# EAGLE design CT-Keypad-Rev4 (EAGLE 6.2)
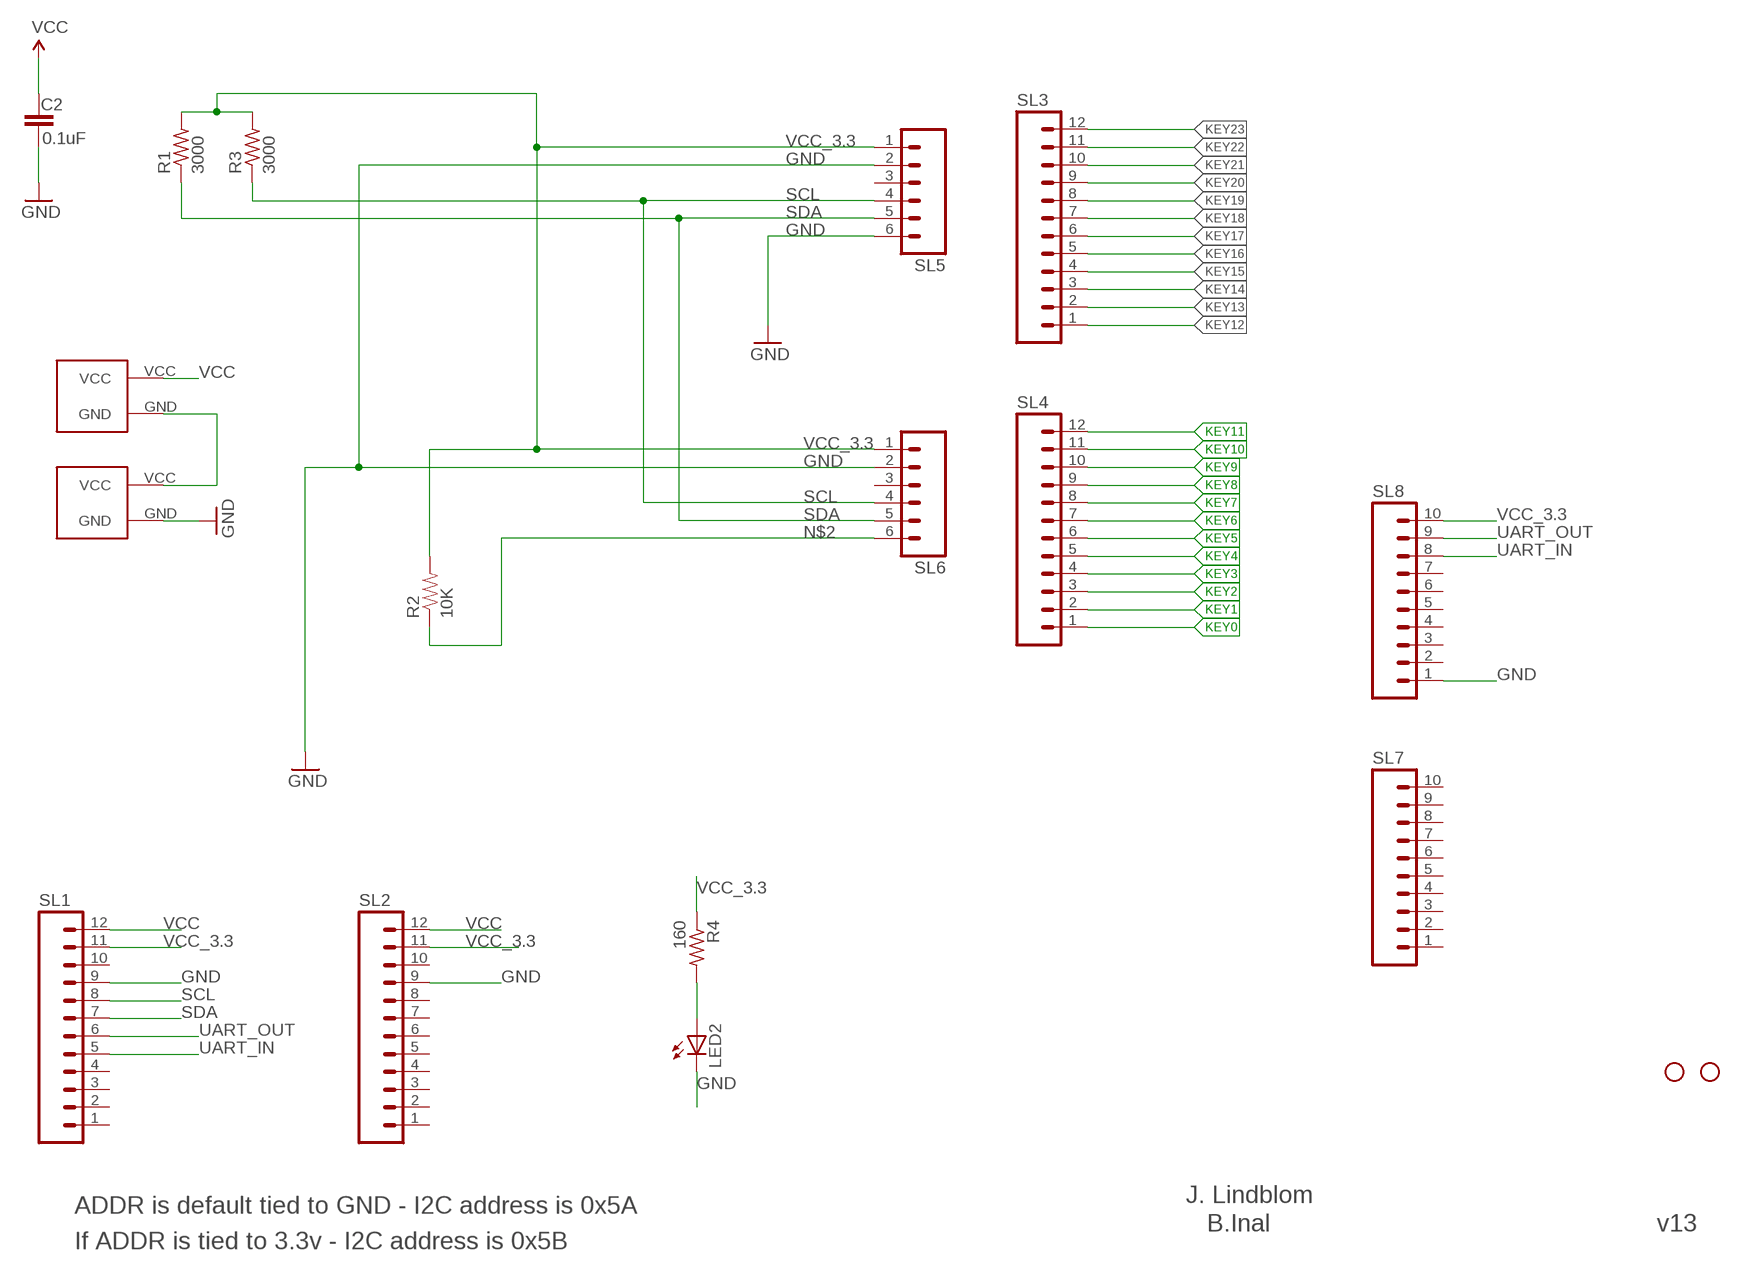
[diagram p0: schematic, sheet 1]

## Parts
C2  0.1uF  0.1UF-25V(+80/-20%)(0603)  [0603-CAP]
JP3  STAND-OFF  [STAND-OFF]
JP4  STAND-OFF  [STAND-OFF]
LED2  LEDCHIPLED_0805  [CHIPLED_0805]
R1  3000  R-US_R0603  [R0603]
R2  10K  10KOHM1/10W1%(0603)0603  [0603-RES]
R3  3000  R-US_R0603  [R0603]
R4  160  R-US_R0603  [R0603]
SL1  M12  [12P]
SL2  M12  [12P]
SL3  M12  [12P]
SL4  M12  [12P]
SL5  M06  [06P]
SL6  M06  [06P]
SL7  M10  [10P]
SL8  M10  [10P]
U$1  BATTERY  [BATTERY]
U$2  BATTERY  [BATTERY]

## Nets
GND: C2.2 LED2.C SL1.9 SL2.9 SL5.2 SL5.6 SL6.2 SL8.1 U$2.GND
KEY0: SL4.1
KEY1: SL4.2
KEY2: SL4.3
KEY3: SL4.4
KEY4: SL4.5
KEY5: SL4.6
KEY6: SL4.7
KEY7: SL4.8
KEY8: SL4.9
KEY9: SL4.10
KEY10: SL4.11
KEY11: SL4.12
KEY12: SL3.1
KEY13: SL3.2
KEY14: SL3.3
KEY15: SL3.4
KEY16: SL3.5
KEY17: SL3.6
KEY18: SL3.7
KEY19: SL3.8
KEY20: SL3.9
KEY21: SL3.10
KEY22: SL3.11
KEY23: SL3.12
N$2: R2.1 SL6.6
N$4: LED2.A R4.2
N$5: U$1.GND U$2.VCC
SCL: R3.1 SL1.8 SL5.4 SL6.4
SDA: R1.1 SL1.7 SL5.5 SL6.5
UART_IN: SL1.5 SL8.8
UART_OUT: SL1.6 SL8.9
VCC: C2.1 SL1.12 SL2.12 U$1.VCC
VCC_3.3: R1.2 R2.2 R3.2 R4.1 SL1.11 SL2.11 SL5.1 SL6.1 SL8.10
Unconnected: SL1.1 SL1.2 SL1.3 SL1.4 SL1.10 SL2.1 SL2.2 SL2.3 SL2.4 SL2.5 SL2.6 SL2.7 SL2.8 SL2.10 SL5.3 SL6.3 SL7.1 SL7.2 SL7.3 SL7.4 SL7.5 SL7.6 SL7.7 SL7.8 SL7.9 SL7.10 SL8.2 SL8.3 SL8.4 SL8.5 SL8.6 SL8.7

## Notes on the sheet
- J. Lindblom
- ADDR is default tied to GND - I2C address is 0x5A
- B.Inal | v13
- If ADDR is tied to 3.3v - I2C address is 0x5B

## Library data of the parts
C2 = SparkFun-Capacitors:0.1UF-25V(+80/-20%)(0603): Ceramic Standard decoupling cap CAP-00810; PROD_ID: CAP-00810
JP3 JP4 = SparkFun:STAND-OFF: Stand Off This is the mechanical footprint for a #4 phillips button head screw. Use the keepout ring to avoid running the screw head into surrounding components. SKU : PRT-00447
LED2 = led:LED: LED OSRAM: - CHIPLED LG R971, LG N971, LY N971, LG Q971, LY Q971, LO R971, LY R971 LH N974, LH R974 LS Q976, LO Q976, LY Q976 LO Q996 - Hyper CHIPLED LW Q18S LB Q993, LB Q99A, LB R99A - SideLED LS A670, LO A670, LY A670, LG A670, LP A670 LB A673, LV A673, LT A673, LW A673 LH A674 LY A675 LS A676, LA A676, LO A676, LY A676, LW A676 LS A679, LY A679, LG A679 - Hyper Micro SIDELED® LS Y876, LA Y876, LO Y876, LY Y876 LT Y87S - SmartLED LW L88C, LW L88S LB L89C, LB L89S, LG L890 LS L89K, LO L89K, LY L89K LS L896, LA L896, LO L896, LY L896 - TOPLED LS T670, LO T670, LY T670, LG T670, LP T670 LSG T670, LSP T670, LSY T670, LOP T670, LYG T670 LG T671, LOG T671, LSG T671 LB T673, LV T673, LT T673, LW T673 LH T674 LS T676, LA T676, LO T676, LY T676, LB T676, LH T676, LSB T676, LW T676 LB T67C, LV T67C, LT T67C, LS T67K, LO T67K, LY T67K, LW E67C LS E67B, LA E67B, LO E67B, LY E67B, LB E67C, LV E67C, LT E67C LW T67C LS T679, LY T679, LG T679 LS T770, LO T770, LY T770, LG T770, LP T770 LB T773, LV T773, LT T773, LW T773 LH T774 LS E675, LA E675, LY E675, LS T675 LS T776, LA T776, LO T776, LY T776, LB T776 LHGB T686 LT T68C, LB T68C - Hyper Mini TOPLED® LB M676 - Mini TOPLED Santana® LG M470 LS M47K, LO M47K, LY M47K Source: http://www.osram.convergy.de LUXEON: - LUMILED® LXK2-PW12-R00, LXK2-PW12-S00, LXK2-PW14-U00, LXK2-PW14-V00 LXK2-PM12-R00, LXK2-PM12-S00, LXK2-PM14-U00 LXK2-PE12-Q00, LXK2-PE12-R00, LXK2-PE12-S00, LXK2-PE14-T00, LXK2-PE14-U00 LXK2-PB12-K00, LXK2-PB12-L00, LXK2-PB12-M00, LXK2-PB14-N00, LXK2-PB14-P00, LXK2-PB14-Q00 LXK2-PR12-L00, LXK2-PR12-M00, LXK2-PR14-Q00, LXK2-PR14-R00 LXK2-PD12-Q00, LXK2-PD12-R00, LXK2-PD12-S00 LXK2-PH12-R00, LXK2-PH12-S00 LXK2-PL12-P00, LXK2-PL12-Q00, LXK2-PL12-R00 Source: www.luxeon.com KINGBRIGHT: KA-3528ASYC Source: www.kingbright.com
R1 R3 R4 = rcl:R-US_: RESISTOR, American symbol
R2 = SparkFun-Resistors:10KOHM1/10W1%(0603): RES-00824; PROD_ID: RES-00824
SL1-SL4 = con-amp-quick:M12: AMP QUICK CONNECTOR; OC_FARNELL: unknown; OC_NEWARK: unknown
SL5 SL6 = con-amp-quick:M06: AMP QUICK CONNECTOR; OC_FARNELL: unknown; OC_NEWARK: unknown
SL7 SL8 = con-amp-quick:M10: AMP QUICK CONNECTOR; OC_FARNELL: unknown; OC_NEWARK: unknown
U$1 U$2 = battery:BATTERY

## Board
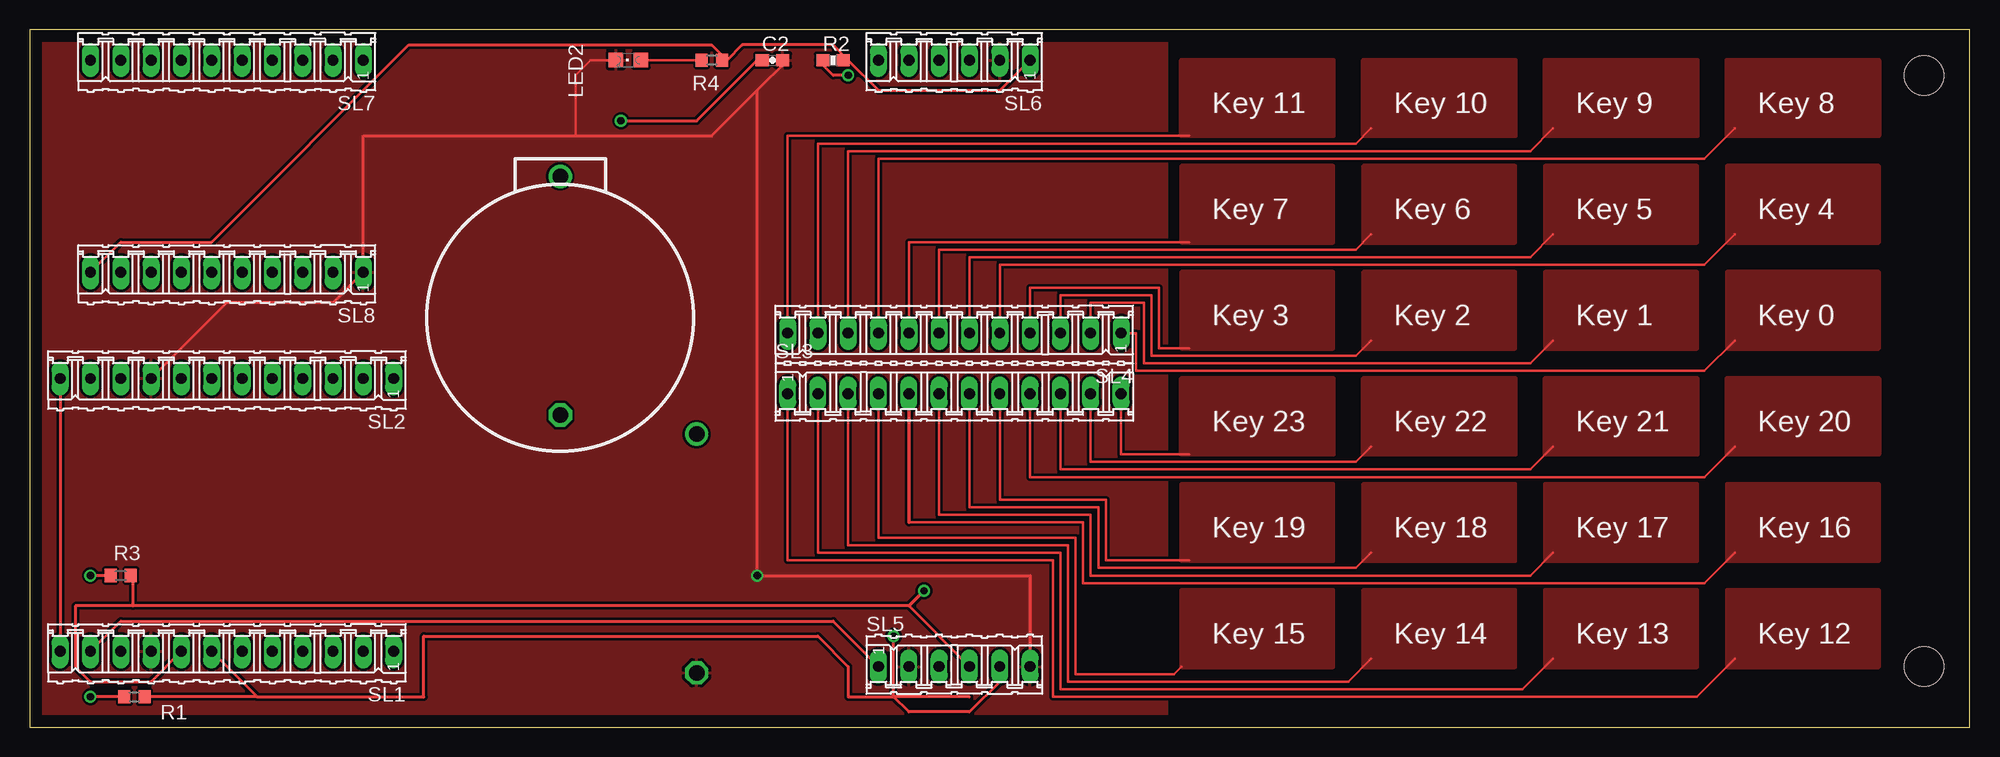
[diagram p1: board, top side]
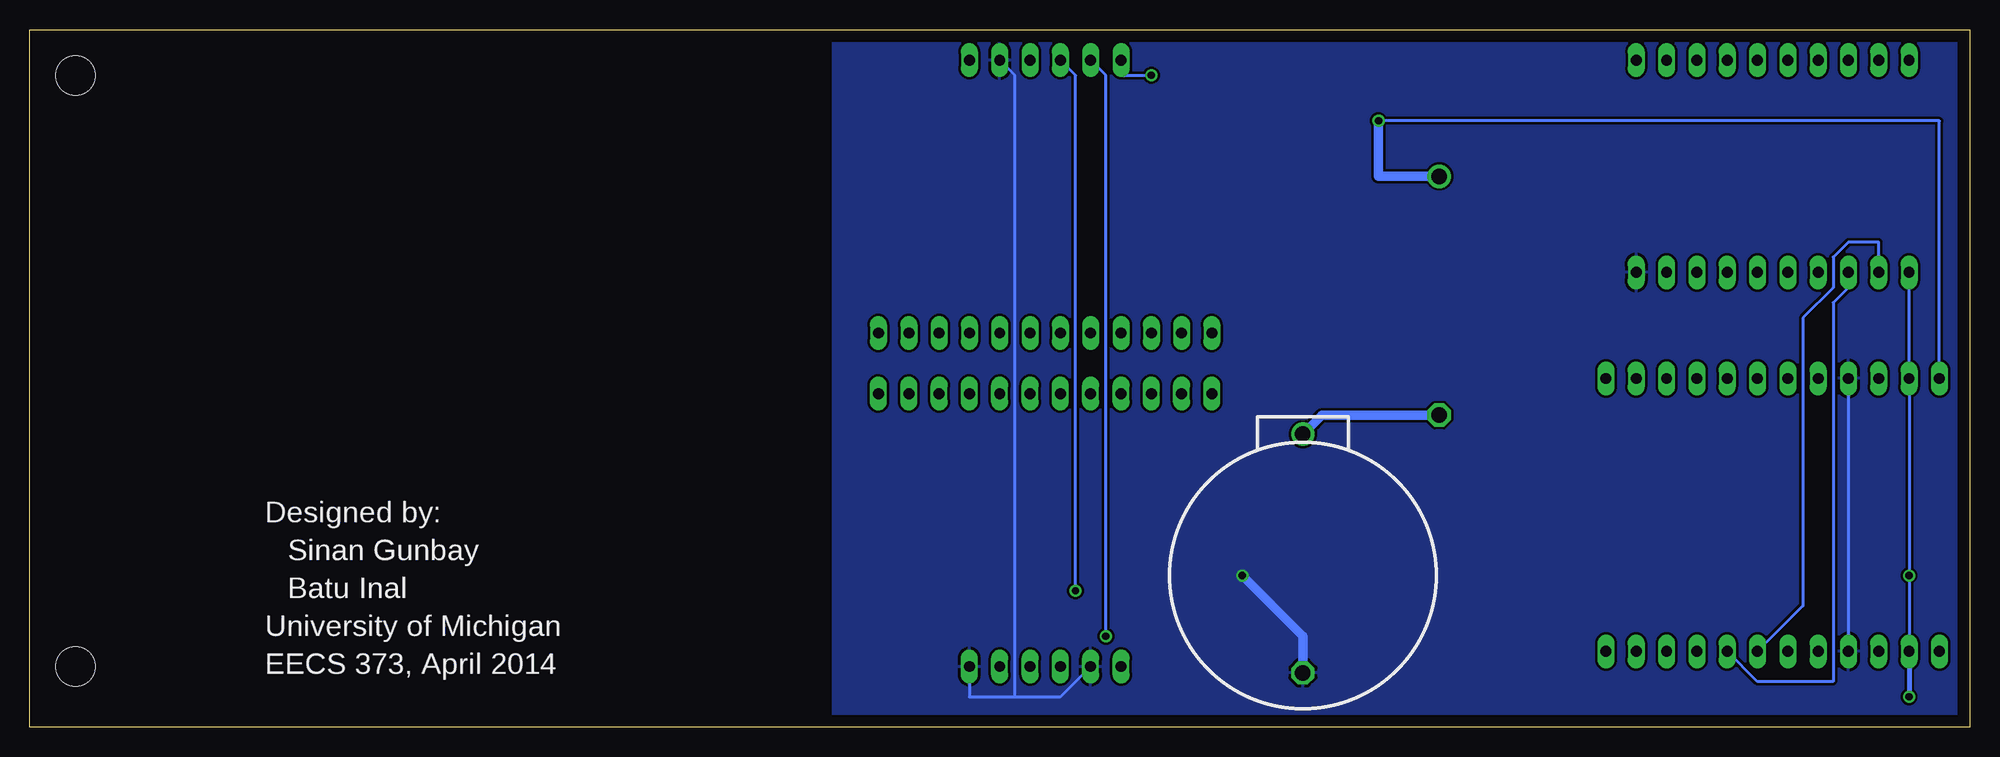
[diagram p2: board, bottom side, seen from below]

Size 162.56 x 58.42 mm. Coordinates in mm from the lower left corner, seen from the top.
Outline: 0,0 162.56,0 162.56,58.42 0,58.42 0,0
Copper layers (1*16): Top 0.035mm / dielectric 1.5mm / Bottom 0.035mm
Design rules: minimum track width 8mil, minimum drill 14mil, track to track 8mil, track to pad 8mil, pad to pad 8mil, via to via 8mil, smd to smd 8mil, copper to edge 40mil, drill to drill 8mil, minimum pad ring 10mil, minimum via ring 8mil, stop-mask expansion 4mil, vias tented up to drill 0mil, thermal gap 10mil

### Footprints (pad centres in the part's own frame; a part is rotated, then mirrored left to right if it is on the bottom)
0603-CAP = smd 1.1 x 1: 1 -0.85,0; 2 0.85,0
STAND-OFF = hole 3.302: 0,0
CHIPLED_0805 = smd 1.2 x 1.2: A 0,-1.05; C 0,1.05
R0603 = smd 1 x 1.1: 1 -0.85,0; 2 0.85,0
0603-RES = smd 1.1 x 1: 1 -0.85,0; 2 0.85,0
12P = drill 0.914 long: 1 -13.97,0; 2 -11.43,0; 3 -8.89,0; 4 -6.35,0; 5 -3.81,0; 6 -1.27,0; 7 1.27,0; 8 3.81,0; 9 6.35,0; 10 8.89,0; 11 11.43,0; 12 13.97,0
06P = drill 0.914 long: 1 -6.35,0; 2 -3.81,0; 3 -1.27,0; 4 1.27,0; 5 3.81,0; 6 6.35,0
10P = drill 0.914 long: 1 -11.43,0; 2 -8.89,0; 3 -6.35,0; 4 -3.81,0; 5 -1.27,0; 6 1.27,0; 7 3.81,0; 8 6.35,0; 9 8.89,0; 10 11.43,0
BATTERY = drill 1.3 octagon: GND -8.15,0 | drill 1.3: VCC 11.85,0

### Placement (x,y rotation side)
C2  62.23,55.88 0 top
JP3  158.75,54.61 0 top
JP4  158.75,5.08 0 top
LED2  50.17,55.88 90 top
R1  8.76,2.54 180 top
R2  67.31,55.88 0 top
R3  7.62,12.7 180 top
R4  57.15,55.88 180 top
SL1  16.51,6.35 180 top
SL2  16.51,29.21 180 top
SL3  77.47,27.94 0 top
SL4  77.47,33.02 180 top
SL5  77.47,5.08 0 top
SL6  77.47,55.88 180 top
SL7  16.51,55.88 180 top
SL8  16.51,38.1 180 top
U$1  44.45,34.29 90 top
U$2  55.88,12.7 90 bottom

### Tracks (layer width: path | path; a pad name or v marks a point on that pad's centre or on a via)
GND  (via drill 0.6)
  Top 0.203: 45.72,49.53 45.72,54.61 46.99,55.88 LED2.C
  Top 0.254: 60.96,53.34 63.5,55.88 C2.2 | SL2.9 16.51,35.56 25.4,35.56 SL8.1 27.94,49.53 45.72,49.53 57.15,49.53 60.96,53.34 | SL5.6 83.82,12.7 v60.96,12.7 60.96,53.34
  Bottom 0.254: SL5.2 76.2,2.54 80.01,2.54 | 80.01,2.54 83.82,2.54 SL5.6 | SL6.2 80.01,54.61 80.01,2.54 | SL2.9 SL1.9
  Bottom 0.813: U$2.GND 55.88,7.62 v60.96,12.7
  pour Bottom: 95.25,60.96 95.25,-2.54 -1.27,-2.54 -1.27,60.96
  pour Top: -3.81,60.96 95.25,60.96 95.25,-2.54 -3.81,-2.54
KEY0
  Top 0.203: SL4.1 92.71,33.02 92.71,29.84 140.34,29.84 142.88,32.38
  pour Top: 154.94,38.1 142.24,38.1 142.24,31.75 154.94,31.75
KEY1
  Top 0.203: SL4.2 88.9,35.56 93.34,35.56 93.34,30.48 125.73,30.48 127.63,32.38
  pour Top: 139.7,38.1 127,38.1 127,31.75 139.7,31.75
KEY2
  Top 0.203: SL4.3 86.36,36.2 93.98,36.2 93.98,31.11 111.12,31.11 112.39,32.38
  pour Top: 124.46,38.1 111.76,38.1 111.76,31.75 124.46,31.75
KEY3
  Top 0.203: SL4.4 83.82,36.83 94.61,36.83 94.61,31.75 97.16,31.75
  pour Top: 109.22,38.1 96.52,38.1 96.52,31.75 109.22,31.75
KEY4
  Top 0.203: SL4.5 81.28,38.73 140.34,38.73 142.88,41.27
  pour Top: 154.94,46.99 142.24,46.99 142.24,40.64 154.94,40.64
KEY5
  Top 0.203: SL4.6 78.74,39.37 125.73,39.37 127.63,41.27
  pour Top: 139.7,46.99 127,46.99 127,40.64 139.7,40.64
KEY6
  Top 0.203: SL4.7 76.2,40.01 111.12,40.01 112.39,41.27
  pour Top: 124.46,46.99 111.76,46.99 111.76,40.64 124.46,40.64
KEY7
  Top 0.203: SL4.8 73.66,40.64 97.16,40.64
  pour Top: 109.22,46.99 96.52,46.99 96.52,40.64 109.22,40.64
KEY8
  Top 0.203: SL4.9 71.12,47.62 140.34,47.62 142.88,50.16
  pour Top: 154.94,55.88 154.94,49.53 142.24,49.53 142.24,55.88
KEY9
  Top 0.203: SL4.10 68.58,48.26 125.73,48.26 127.63,50.16
  pour Top: 139.7,55.88 139.7,49.53 127,49.53 127,55.88
KEY10
  Top 0.203: SL4.11 66.04,48.9 111.12,48.9 112.39,50.16
  pour Top: 124.46,55.88 124.46,49.53 111.76,49.53 111.76,55.88
KEY11
  Top 0.203: SL4.12 63.5,49.53 97.16,49.53
  pour Top: 109.22,55.88 109.22,49.53 96.52,49.53 96.52,55.88
KEY12
  Top 0.203: SL3.1 63.5,13.97 85.72,13.97 85.72,2.54 139.7,2.54 142.88,5.71
  pour Top: 154.94,11.43 142.24,11.43 142.24,5.08 154.94,5.08
KEY13
  Top 0.203: SL3.2 66.04,14.61 86.36,14.61 86.36,3.17 125.09,3.17 127.63,5.71
  pour Top: 139.7,11.43 127,11.43 127,5.08 139.7,5.08
KEY14
  Top 0.203: SL3.3 68.58,15.24 86.99,15.24 86.99,3.81 110.49,3.81 112.39,5.71
  pour Top: 124.46,11.43 111.76,11.43 111.76,5.08 124.46,5.08
KEY15
  Top 0.203: SL3.4 71.12,15.88 87.63,15.88 87.63,4.45 95.88,4.45 96.52,5.08
  pour Top: 109.22,11.43 96.52,11.43 96.52,5.08 109.22,5.08
KEY16
  Top 0.203: 73.66,17.14 88.27,17.14 88.27,12.06 140.34,12.06 142.88,14.61
  Top 0.305: SL3.5 73.66,17.14
  pour Top: 154.94,20.32 142.24,20.32 142.24,13.97 154.94,13.97
KEY17
  Top 0.203: SL3.6 76.2,17.78 88.9,17.78 88.9,12.7 125.73,12.7 127.63,14.61
  pour Top: 139.7,20.32 127,20.32 127,13.97 139.7,13.97
KEY18
  Top 0.203: SL3.7 78.74,18.41 89.53,18.41 89.53,13.34 111.12,13.34 112.39,14.61
  pour Top: 124.46,20.32 111.76,20.32 111.76,13.97 124.46,13.97
KEY19
  Top 0.203: SL3.8 81.28,19.05 90.17,19.05 90.17,13.97 97.16,13.97
  pour Top: 109.22,20.32 96.52,20.32 96.52,13.97 109.22,13.97
KEY20
  Top 0.203: SL3.9 83.82,20.95 140.34,20.95 142.88,23.5
  pour Top: 154.94,29.21 154.94,22.86 142.24,22.86 142.24,29.21
KEY21
  Top 0.203: SL3.10 86.36,21.59 125.73,21.59 127.63,23.5
  pour Top: 139.7,29.21 139.7,22.86 127,22.86 127,29.21
KEY22
  Top 0.203: SL3.11 88.9,22.23 111.12,22.23 112.39,23.5
  pour Top: 124.46,29.21 124.46,22.86 111.76,22.86 111.76,29.21
KEY23
  Top 0.203: SL3.12 91.44,22.86 97.16,22.86
  pour Top: 109.22,29.21 109.22,22.86 96.52,22.86 96.52,29.21
N$2  (via drill 0.61)
  Top 0.254: v68.58,54.61 67.31,54.61 66.04,55.88 R2.1
  Bottom 0.254: v68.58,54.61 71.12,54.61 SL6.6
N$4
  Top 0.203: LED2.A R4.2
  Top 0.254: 55.88,55.88 R4.2
N$5
  Bottom 0.813: U$1.GND 54.29,26.14 U$2.VCC
SCL  (via drill 0.61)
  Top 0.254: SL5.4 73.66,10.16 8.64,10.16 | SL1.8 10.16,3.81 5.08,3.81 3.81,5.08 3.81,10.16 8.64,10.16 | R3.1 8.64,12.7 8.64,10.16
  Top 0.305: 73.66,10.16 v74.93,11.43
  Bottom 0.254: SL6.4 74.93,54.61 v74.93,11.43
SDA  (via drill 0.61)
  Top 0.254: 19.05,2.54 SL1.7 | 78.74,2.54 72.39,2.54 | 72.39,2.54 v72.39,7.62 | 19.05,2.54 R1.1 | 19.05,2.54 33.02,2.54 33.02,7.62 66.04,7.62 68.58,5.08 68.58,2.54 72.39,2.54 | 72.39,2.54 73.66,1.27 78.74,1.27 81.28,3.81 SL5.5
  Bottom 0.254: v72.39,7.62 72.39,54.61 SL6.5
UART_IN
  Bottom 0.254: SL8.8 10.16,36.83 11.43,35.56 11.43,3.81 17.78,3.81 SL1.5
UART_OUT
  Bottom 0.254: SL8.9 7.62,40.64 10.16,40.64 11.43,39.37 11.43,36.83 13.97,34.29 13.97,10.16 SL1.6
VCC  (via drill 0.61)
  Top 0.254: v49.53,50.8 55.88,50.8 60.96,55.88 C2.1 | SL2.12 SL1.12
  Bottom 0.254: v49.53,50.8 2.54,50.8 SL2.12
  Bottom 0.813: U$1.VCC 49.53,46.14 v49.53,50.8
VCC_3.3  (via drill 0.6)
  Top 0.254: 58.42,55.88 59.69,57.15 67.31,57.15 68.58,55.88 | SL6.1 81.28,53.34 71.12,53.34 68.58,55.88 | 68.58,55.88 R2.2 | SL5.1 67.31,8.89 7.62,8.89 SL1.11 | 58.42,55.88 57.15,57.15 31.75,57.15 15.24,40.64 7.62,40.64 SL8.10 | 58.42,55.88 R4.1 | R1.2 v5.08,2.54 | R3.2 v5.08,12.7
  Bottom 0.254: SL8.10 SL2.11 v5.08,12.7 SL1.11
  Bottom 0.406: SL1.11 v5.08,2.54

### Text on the board
tPlace: Key 11 | Key 10 | Key 9 | Key 8 | Key 7 | Key 6 | Key 5 | Key 4 | Key 3 | Key 2 | Key 1 | Key 0 | Key 23 | Key 22 | Key 21 | Key 20 | Key 19 | Key 18 | Key 17 | Key 16 | Key 15 | Key 14 | Key 13 | Key 12
bPlace: Designed by: | Sinan Gunbay | Batu Inal | University of Michigan | EECS 373, April 2014